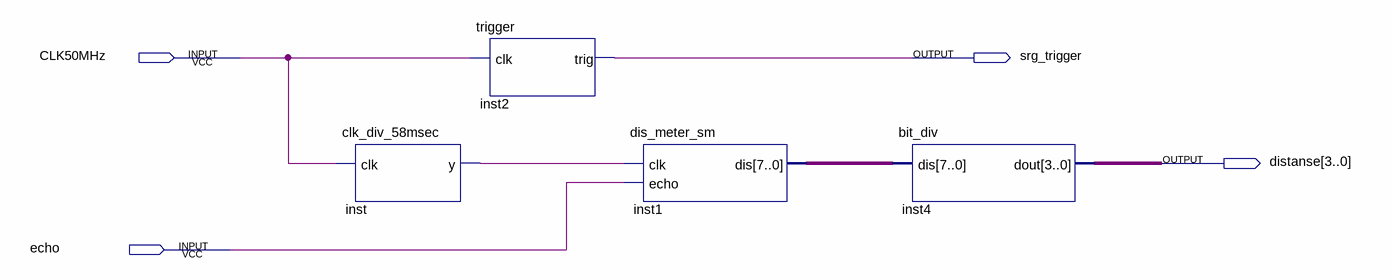
[diagram p0: schematic sheet]
// Quartus schematic HC-SR04.bdf as structural Verilog: 4 symbols, 4 pins
module \HC-SR04  (
  input  CLK50MHz,
  input  echo,
  output srg_trigger,
  output [3:0] distanse
);

  wire inst_y;
  wire [7:0] inst1_dis;

  clk_div_58msec inst (.clk(CLK50MHz), .y(inst_y));
  trigger inst2 (.clk(CLK50MHz), .trig(srg_trigger));
  dis_meter_sm inst1 (.clk(inst_y), .echo(echo), .dis(inst1_dis));
  bit_div inst4 (.dis(inst1_dis), .dout(distanse));
endmodule
